# EAGLE schematic arm_pcbqr_v4 (EAGLE 5.11)
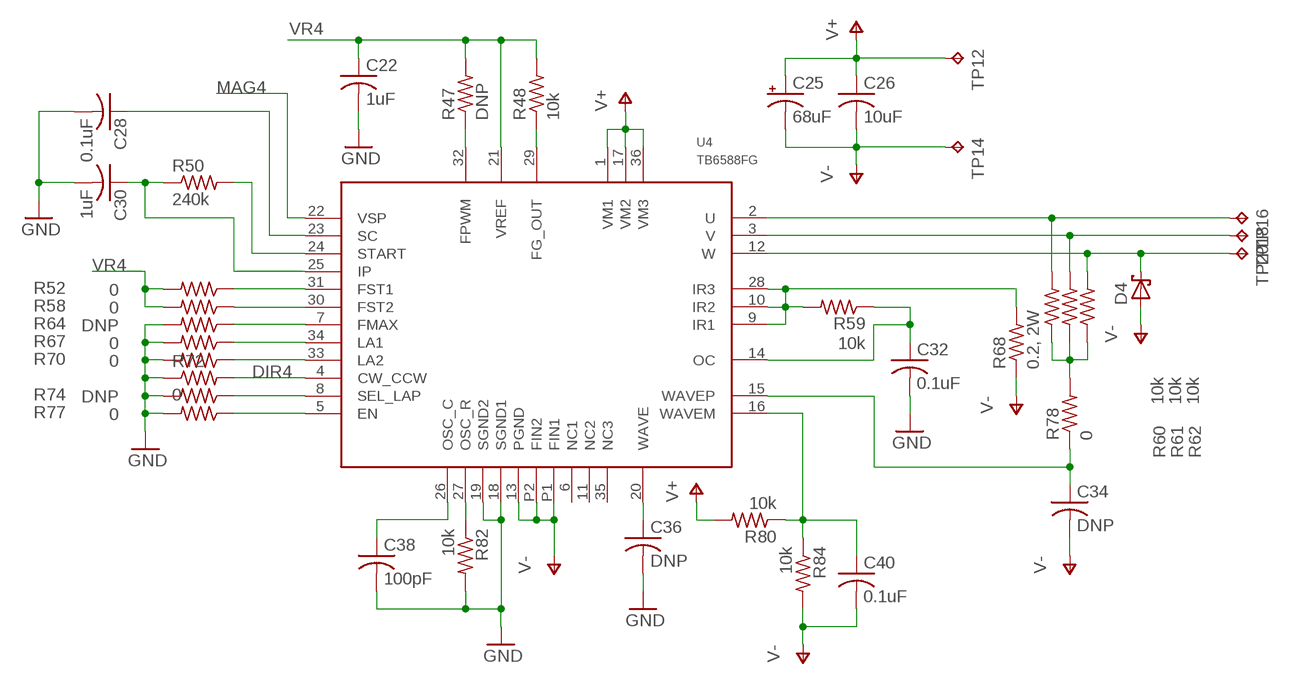
[diagram p0: schematic, sheet 1]

## Parts
C22  1uF  C-USC0603  [C0603]
C25  68uF  CPOL-USD  [PANASONIC_D]
C26  10uF  C-USC1206  [C1206]
C28  0.1uF  C-USC0603  [C0603]
C30  1uF  C-USC0603  [C0603]
C32  0.1uF  C-USC0603  [C0603]
C34  DNP  C-USC0603  [C0603]
C36  DNP  C-USC0603  [C0603]
C38  100pF  C-USC0603  [C0603]
C40  0.1uF  C-USC0603  [C0603]
D4  SCHOTTKY_SMA  [SMA]
R47  DNP  R-US_R0603  [R0603]
R48  10k  R-US_R0603  [R0603]
R50  240k  R-US_R0603  [R0603]
R52  0  R-US_R0603  [R0603]
R58  0  R-US_R0603  [R0603]
R59  10k  R-US_R0603  [R0603]
R60  10k  R-US_R0603  [R0603]
R61  10k  R-US_R0603  [R0603]
R62  10k  R-US_R0603  [R0603]
R64  DNP  R-US_R0603  [R0603]
R67  0  R-US_R0603  [R0603]
R68  0.2, 2W  R-US_R2512  [R2512]
R70  0  R-US_R0603  [R0603]
R72  0  R-US_R0603  [R0603]
R74  DNP  R-US_R0603  [R0603]
R77  0  R-US_R0603  [R0603]
R78  0  R-US_R0603  [R0603]
R80  10k  R-US_R0603  [R0603]
R82  10k  R-US_R0603  [R0603]
R84  10k  R-US_R0603  [R0603]
TP12  TPTP20SQ  [TP20SQ]
TP14  TPTP20SQ  [TP20SQ]
TP16  TPTP20SQ  [TP20SQ]
TP18  TPTP20SQ  [TP20SQ]
TP20  TPTP20SQ  [TP20SQ]
U4  TB6588FG  [HSOP36-P-450-0.65]

## Nets
DIR4: R72.2 U4.4(CW_CCW)
GND: C22.2 C28.2 C30.2 C32.2 C36.2 C38.2 R64.2 R67.2 R70.2 R72.1 R74.2 R77.2 R82.2 U4.18(SGND1) U4.19(SGND2)
MAG4: U4.22(VSP)
N$72: R59.2 R68.2 U4.9(IR1) U4.10(IR2) U4.28(IR3)
N$73: R60.2 TP16.TP U4.2(U)
N$74: R61.2 TP18.TP U4.3(V)
N$75: D4.C R62.2 TP20.TP U4.12(W)
N$76: R77.1 U4.5(EN)
N$77: R74.1 U4.8(SEL_LAP)
N$78: R70.1 U4.33(LA2)
N$79: R67.1 U4.34(LA1)
N$80: R64.1 U4.7(FMAX)
N$81: C38.1 U4.26(OSC_C)
N$82: R82.1 U4.27(OSC_R)
N$83: R58.1 U4.30(FST2)
N$84: R52.1 U4.31(FST1)
N$85: R50.2 U4.24(START)
N$86: C30.1 R50.1 U4.25(IP)
N$87: C28.1 U4.23(SC)
N$88: R47.1 U4.32(FPWM)
N$89: R48.1 U4.29(FG_OUT)
N$90: R60.1 R61.1 R62.1 R78.2
N$91: C34.1 R78.1 U4.15(WAVEP)
N$92: C32.1 R59.1 U4.14(OC)
N$93: C40.1 R80.1 R84.1 U4.16(WAVEM)
N$94: C36.1 U4.20(WAVE)
V+: C25.+ C26.1 R80.2 TP12.TP U4.1(VM1) U4.17(VM2) U4.36(VM3)
V-: C25.- C26.2 C34.2 C40.2 D4.A R68.1 R84.2 TP14.TP U4.13(PGND) U4.P1(FIN1) U4.P2(FIN2)
VR4: C22.1 R47.2 R48.2 R52.2 R58.2 U4.21(VREF)
Unconnected: U4.6(NC1) U4.11(NC2) U4.35(NC3)

## Library data of the parts
C22 C26 C28 C30 C32 C34 C36 C38 C40 = rcl:C-US: CAPACITOR, American symbol
C25 = rcl:CPOL-US: POLARIZED CAPACITOR, American symbol
D4 = sc_usercreated:SCHOTTKY_SMA
R47 R48 R50 R52 R58-R62 R64 R67 R68 R70 R72 R74 R77 R78 R80 R82 R84 = rcl:R-US_: RESISTOR, American symbol
TP12 TP14 TP16 TP18 TP20 = testpad:TP: Test pad
U4 = sc_usercreated:TB6588FG

## Net classes
0 default: width 0.203 mm, drill 0.381 mm, clearance 0.203 mm
1 power: width 0.254 mm, drill 0.381 mm, clearance 0.203 mm
3 usbvcc: width 0.508 mm, drill 0.381 mm, clearance 0.203 mm